# EAGLE schematic Welder_PSU_02 (EAGLE 9.6.2)
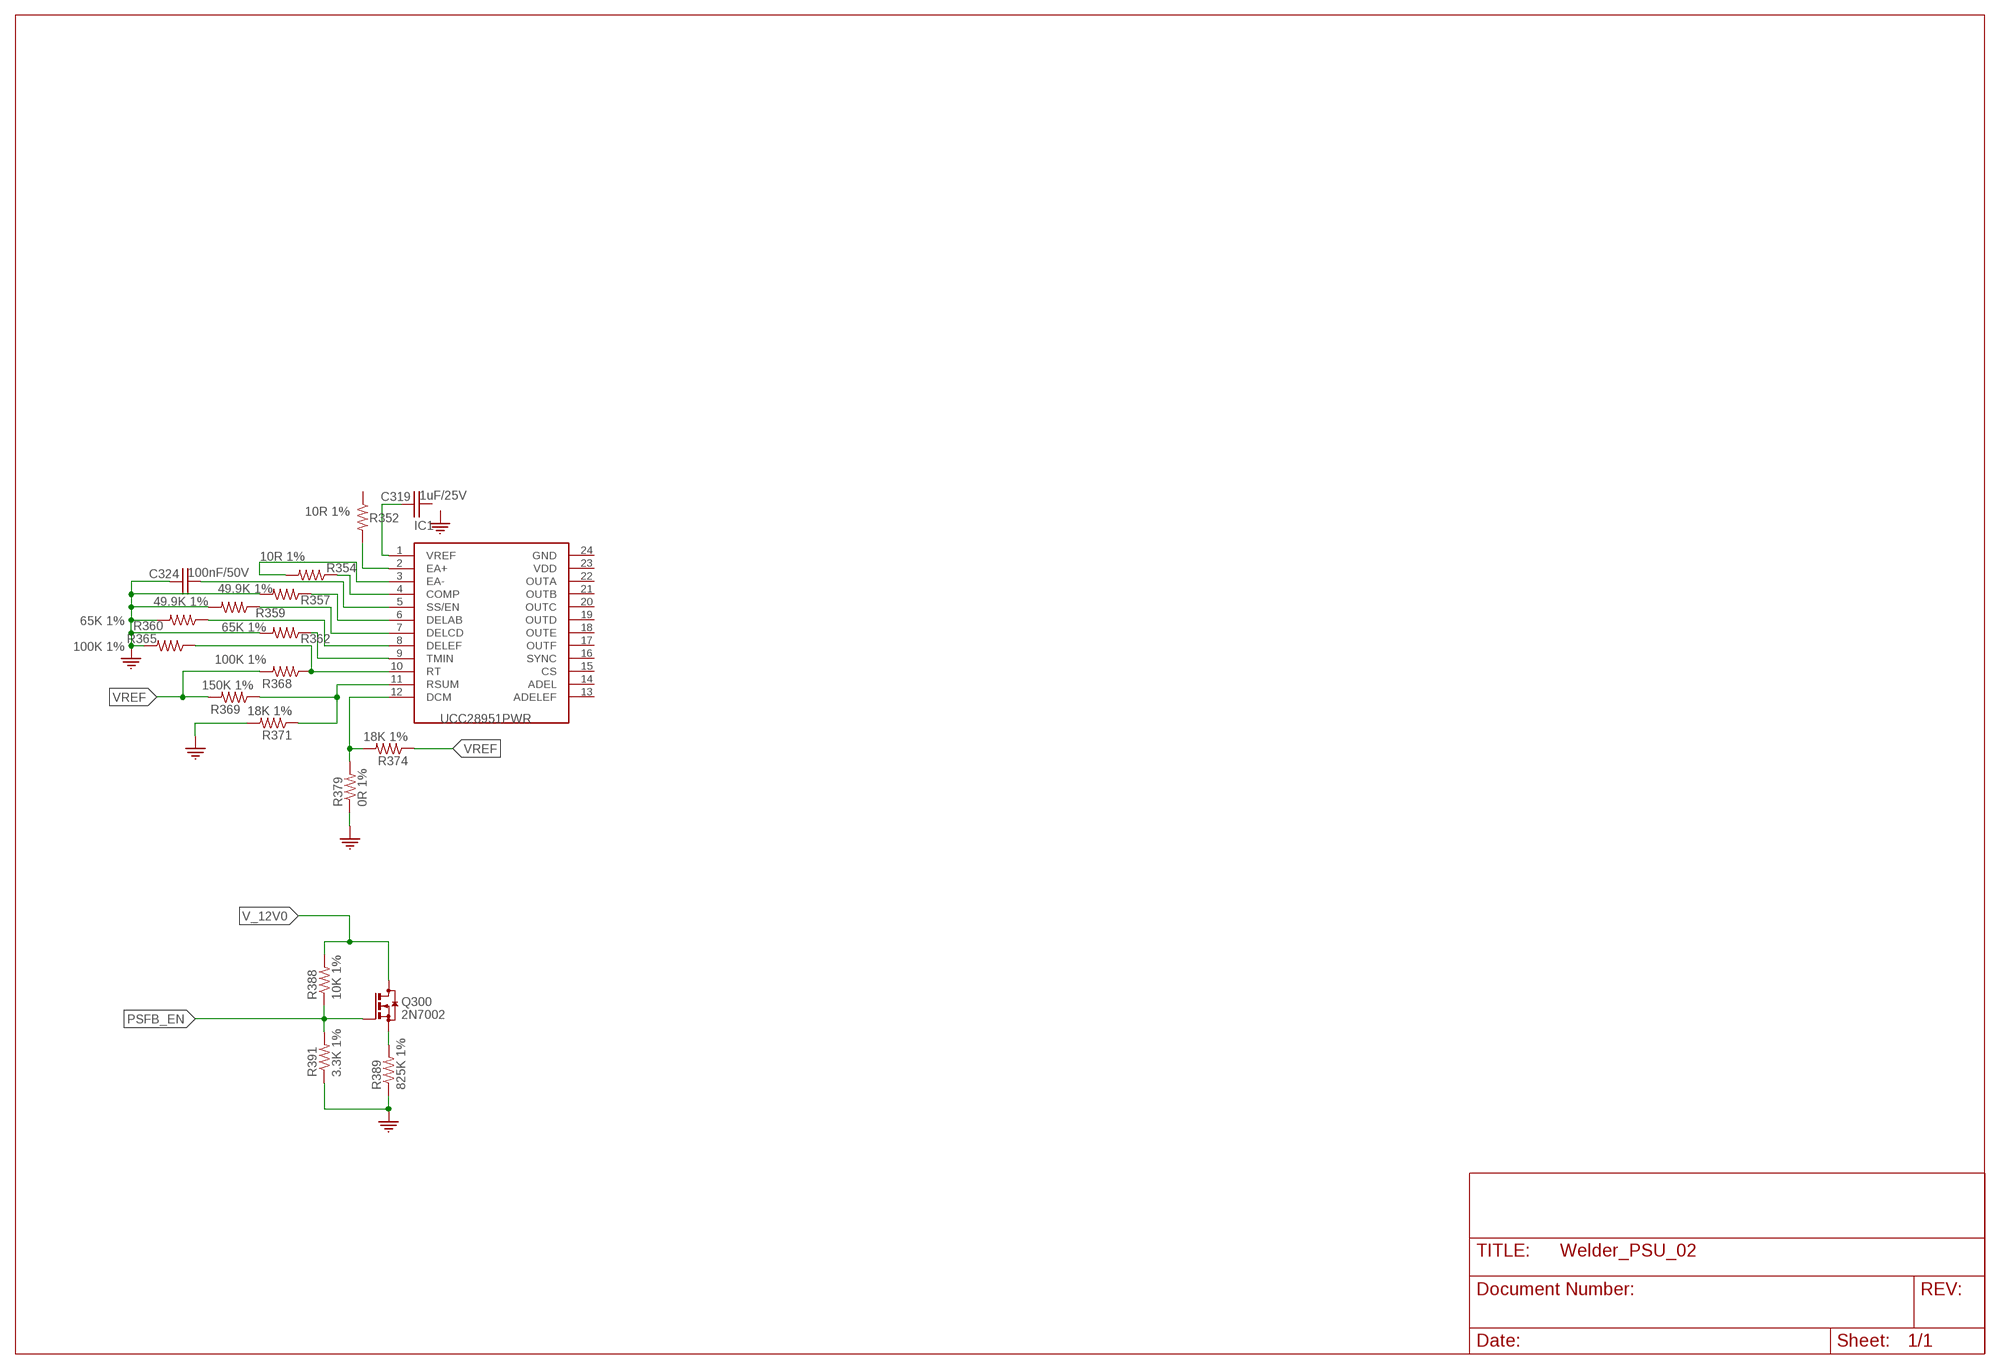
[diagram p0: schematic, sheet 1]

## Parts
C319  1uF/25V  C_0603EIA0603  [EIA0603]
C324  100nF/50V  C_0603EIA0603  [EIA0603]
IC1  UCC28951PWR  [TSSOP24]
Q300  2N7002  [SOT23]
R352  10R 1%  R_0603  [EIA0603]
R354  10R 1%  R_0603  [EIA0603]
R357  49.9K 1%  R_0603  [EIA0603]
R359  49.9K 1%  R_0603  [EIA0603]
R360  65K 1%  R_0603  [EIA0603]
R362  65K 1%  R_0603  [EIA0603]
R365  100K 1%  R_0603  [EIA0603]
R368  100K 1%  R_0603  [EIA0603]
R369  150K 1%  R_0603  [EIA0603]
R371  18K 1%  R_0603  [EIA0603]
R374  18K 1%  R_0603  [EIA0603]
R379  0R 1%  R_0603  [EIA0603]
R388  10K 1%  R_0603  [EIA0603]
R389  825K 1%  R_0603  [EIA0603]
R391  3.3K 1%  R_0603  [EIA0603]

## Nets
GND: C324.1 R357.2 R359.2 R360.2 R362.2 R365.2 R371.2 R379.1 R389.1 R391.1
N$1: Q300.2(S) R389.2
N$2: IC1.12(DCM) R374.2 R379.2
N$3: IC1.11(RSUM) R369.1 R371.1
N$4: IC1.10(RT) R365.1 R368.1
N$5: IC1.9(TMIN) R362.1
N$6: IC1.8(DELEF) R360.1
N$7: IC1.6(DELAB) R357.1
N$8: IC1.7(DELCD) R359.1
N$9: IC1.4(COMP) R354.1
N$10: IC1.3(EA-) R354.2
N$11: C324.2 IC1.5(SS/EN)
N$12: IC1.2(EA+) R352.2
N$13: C319.1 IC1.1(VREF)
PSFB_EN: Q300.1(G) R388.1 R391.2
V_12V0: Q300.3(D) R388.2
VREF: R368.2 R369.2 R374.1
Unconnected: C319.2 IC1.13(ADELEF) IC1.14(ADEL) IC1.15(CS) IC1.16(SYNC) IC1.17(OUTF) IC1.18(OUTE) IC1.19(OUTD) IC1.20(OUTC) IC1.21(OUTB) IC1.22(OUTA) IC1.23(VDD) IC1.24(GND) R352.1

## Library data of the parts
C319 C324 = Labops_Lib_AH:C_0603
IC1 = Labops_Lib_AH:UCC28951PWR: Phase Shift Full Bridge SMPS Controller, TI, TSSOP-24; DESCRIPTION: Phase Shift Full Bridge Controller, TSSOP24; MFN: UCC28951QPWRQ1; MFR: Texas Instruments; PART_VALUE: UCC28951
Q300 = Labops_Lib_AH:2N7002; DESCRIPTION: NMOSFET, 500mA, 60V, Vth 2.5V; LIB_STATUS: Prototype; MFN: 2N7002; MFR: Diodes, Guangdong Hotetech,NXP; OUR_STOCK: 100; PART_VALUE: NMOSFET; PRICE-1: 0.02; SUPPLIER-1: LCSC
R352 R354 R357 R359 R360 R362 R365 R368 R369 R371 R374 R379 R388 R389 R391 = Labops_Lib_AH:R_0603; MFN: Open Source 0603